# Altium schematic sheet FPGA_POWER.SchDoc
size A; SheetNumber: 2; SheetTotal: 2
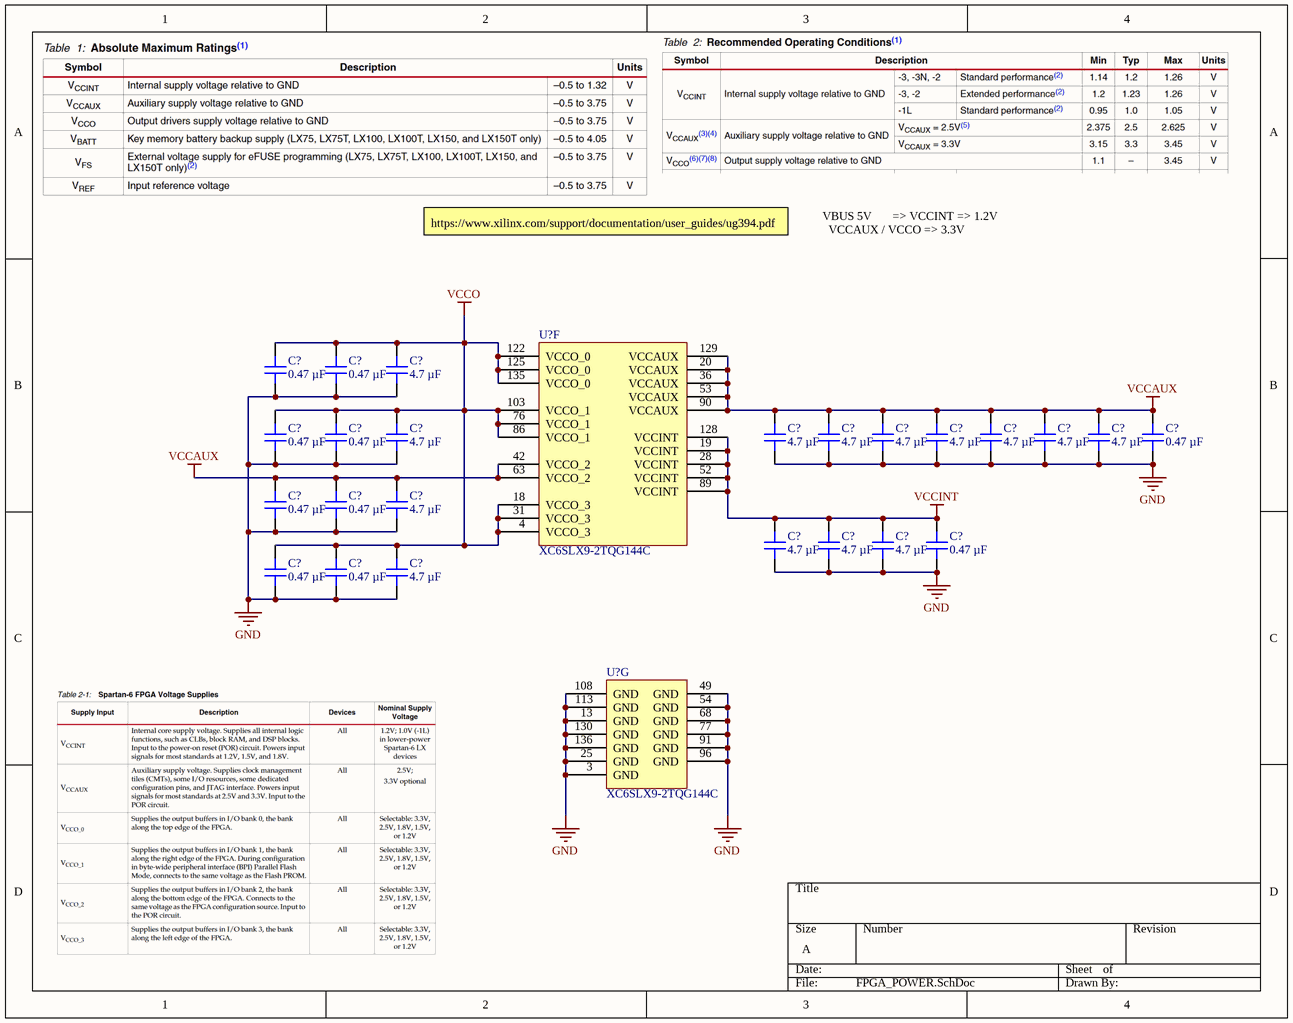
[diagram p0: FPGA_POWER.SchDoc]

## Parts
(Parts that share a designator on the sheet are numbered #1, #2 ... from top to bottom, then left to right.)
C?#1  0.47 µF  [CAP 0402_1005]
C?#2  0.47 µF  [CAP 0402_1005]
C?#3  4.7 µF  [CAP 0805_2012]
C?#4  0.47 µF  [CAP 0402_1005]
C?#5  0.47 µF  [CAP 0402_1005]
C?#6  4.7 µF  [CAP 0805_2012]
C?#7  4.7 µF  [CAP 0805_2012]
C?#8  4.7 µF  [CAP 0805_2012]
C?#9  4.7 µF  [CAP 0805_2012]
C?#10  4.7 µF  [CAP 0805_2012]
C?#11  4.7 µF  [CAP 0805_2012]
C?#12  4.7 µF  [CAP 0805_2012]
C?#13  4.7 µF  [CAP 0805_2012]
C?#14  0.47 µF  [CAP 0402_1005]
C?#15  0.47 µF  [CAP 0402_1005]
C?#16  0.47 µF  [CAP 0402_1005]
C?#17  4.7 µF  [CAP 0805_2012]
C?#18  4.7 µF  [CAP 0805_2012]
C?#19  4.7 µF  [CAP 0805_2012]
C?#20  4.7 µF  [CAP 0805_2012]
C?#21  0.47 µF  [CAP 0402_1005]
C?#22  0.47 µF  [CAP 0402_1005]
C?#23  0.47 µF  [CAP 0402_1005]
C?#24  4.7 µF  [CAP 0805_2012]
U?#1  XC6SLX9-2TQG144C  [TQG144_N]  (part F of 7)
U?#2  XC6SLX9-2TQG144C  [TQG144_N]  (part G of 7)

## Nets
GND: C?#1.1 C?#2.1 C?#3.1 C?#4.1 C?#5.1 C?#6.1 C?#7.1 C?#8.1 C?#9.1 C?#10.1 C?#11.1 C?#12.1 C?#13.1 C?#14.1 C?#15.1 C?#16.1 C?#17.1 C?#18.1 C?#19.1 C?#20.1 C?#21.1 C?#22.1 C?#23.1 C?#24.1 U?#2.3(GND) U?#2.13(GND) U?#2.25(GND) U?#2.49(GND) U?#2.54(GND) U?#2.68(GND) U?#2.77(GND) U?#2.91(GND) U?#2.96(GND) U?#2.108(GND) U?#2.113(GND) U?#2.130(GND) U?#2.136(GND)
VCCAUX: C?#7.2 C?#8.2 C?#9.2 C?#10.2 C?#11.2 C?#12.2 C?#13.2 C?#14.2 C?#15.2 C?#16.2 C?#17.2 U?#1.20(VCCAUX) U?#1.36(VCCAUX) U?#1.42(VCCO_2) U?#1.53(VCCAUX) U?#1.63(VCCO_2) U?#1.90(VCCAUX) U?#1.129(VCCAUX)
VCCINT: C?#18.2 C?#19.2 C?#20.2 C?#21.2 U?#1.19(VCCINT) U?#1.28(VCCINT) U?#1.52(VCCINT) U?#1.89(VCCINT) U?#1.128(VCCINT)
VCCO: C?#1.2 C?#2.2 C?#3.2 C?#4.2 C?#5.2 C?#6.2 C?#22.2 C?#23.2 C?#24.2 U?#1.4(VCCO_3) U?#1.18(VCCO_3) U?#1.31(VCCO_3) U?#1.76(VCCO_1) U?#1.86(VCCO_1) U?#1.103(VCCO_1) U?#1.122(VCCO_0) U?#1.125(VCCO_0) U?#1.135(VCCO_0)

## Notes on the sheet
- https://www.xilinx.com/support/documentation/user_guides/ug394.pdf
- VBUS 5V	      =>	VCCINT => 1.2V
  VCCAUX / VCCO => 3.3V

## Library data of the parts
C?#1 C?#2 C?#4 C?#5 C?#14-C?#16 C?#21-C?#23 = CL05A474KQ5NNNC: CAP CER 0.47UF 6.3V X5R 0402; manufacturer: Samsung Electro-Mechanics; Tolerance: ±10%; Part Number: CL05A474KQ5NNNC; Value: 0.47 µF; Applications: General Purpose; Capacitance: 0.47 µF; componentlink1description: Datasheet; componentlink1url: http://www.samsungsem.com/kr/support/product-search/mlcc/CL05A474KQ5NNNC.jsp; componentlink2description: DigiKey Link; componentlink2url: https://www.digikey.com/en/products/detail/samsung-electro-mechanics/CL05A474KQ5NNNC/3887137; Device Package: 0402 (1005 Metric); lastupdated: 2/26/2022 9:02:43 AM; Lifecycle Status: Active; Minimum Order: 1; Mounting Type: Surface Mount, MLCC; Operating Temperature: -55°C ~ 85°C; Package / Case: 0402 (1005 Metric); packaging: TapeAndReel; partid: 3146; Part Status: Active; price: 0.01; series: CL; Size / Dimension: 0.039" L x 0.020" W (1.00mm x 0.50mm); Supplier 1: DigiKey; Supplier Part Number 1: 1276-1479-1-ND; Temperature Coefficient: X5R; Thickness (Max): 0.022" (0.55mm); Voltage - Rated: 6.3V
C?#3 C?#6-C?#13 C?#17-C?#20 C?#24 = CL21A475KQFNNNG: CAP CER 4.7UF 6.3V X5R 0805; manufacturer: Samsung Electro-Mechanics; Tolerance: ±10%; Part Number: CL21A475KQFNNNG; Value: 4.7 µF; Applications: General Purpose; Capacitance: 4.7 µF; componentlink1description: Datasheet; componentlink1url: http://www.samsungsem.com/kr/support/product-search/mlcc/CL21A475KQFNNNG.jsp; componentlink2description: DigiKey Link; componentlink2url: https://www.digikey.com/en/products/detail/samsung-electro-mechanics/CL21A475KQFNNNG/3894444; Device Package: 0805 (2012 Metric); lastupdated: 2/28/2022 4:39:14 PM; Lifecycle Status: Active; Minimum Order: 1; Mounting Type: Surface Mount, MLCC; Operating Temperature: -55°C ~ 85°C; Package / Case: 0805 (2012 Metric); packaging: TapeAndReel; partid: 4972; Part Status: Active; price: 0.02; series: CL; Size / Dimension: 0.079" L x 0.049" W (2.00mm x 1.25mm); Supplier 1: DigiKey; Supplier Part Number 1: 1276-6465-1-ND; Temperature Coefficient: X5R; Thickness (Max): 0.053" (1.35mm); Voltage - Rated: 6.3V
U?#1 U?#2 = CMP-0067-00454-1: Spartan-6 LX 1.2V FPGA, 102 User I/Os, 144-Pin TQFP (0.5mm Pitch), Speed Grade 2, Commercial Grade, Pb-Free; PackageVersion: ver1.2, Jun-2004; DatasheetVersion: ver1.6, Nov-2010; PackageDescription: 144-Pin Thin Quad Flat Pack (TQG144) - Pb-Free; PackageReference: TQG144; Code_JEDEC: MS-026-BFB